# EasyEDA Pro project ProDocument_PCB1_2023-08-22.epro

# Board PCB1
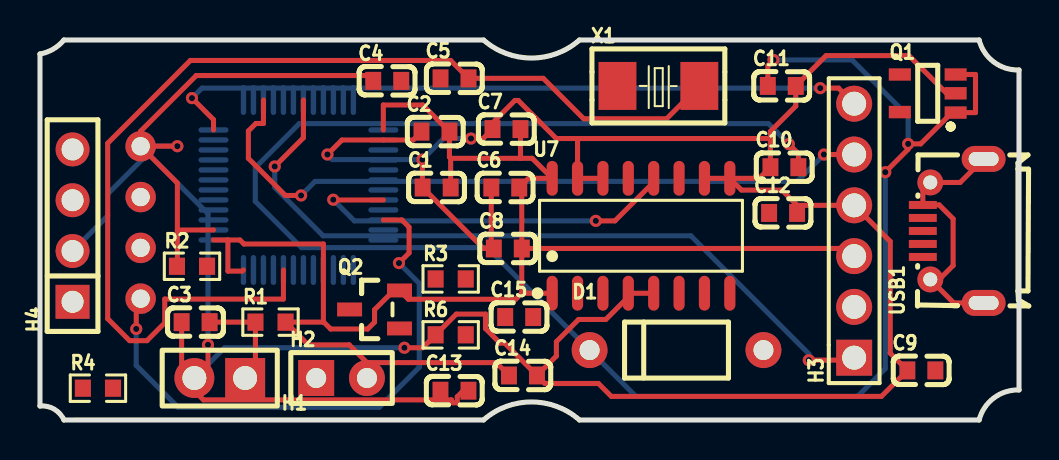
[diagram p0: board, top side]
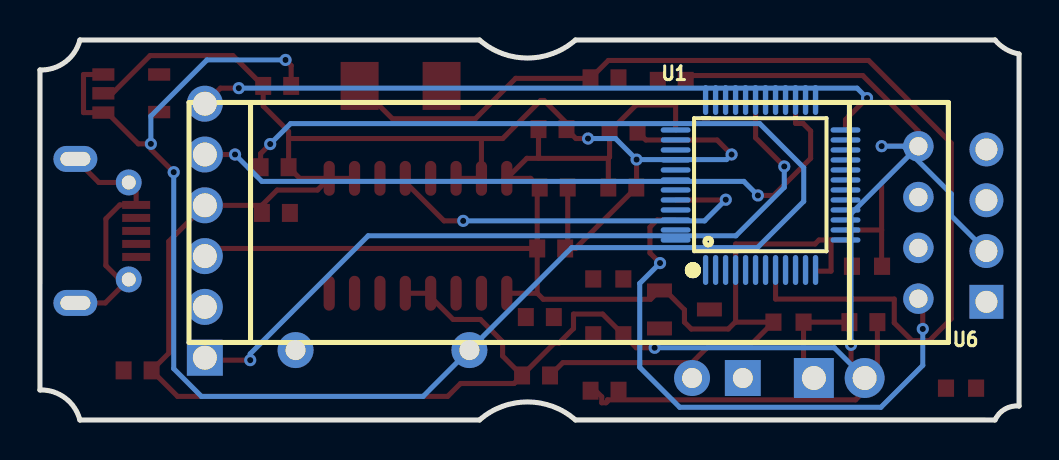
[diagram p1: board, bottom side, seen from below]

Outline 49 x 19 mm; copper layers: Top Layer, Bottom Layer. Coordinates in mm from the lower left corner of the outline.
Outline path: 0,0.7 0,18.3 arc(0.66,18.54) 1.2,19 22.2,19 arc(24.6,18.1) 27,19 47,19 arc(47.74,17.9) 49,17.5 49,1.5 arc(47.74,1.1) 47,0 27,0 arc(24.6,0.9) 22.2,0 1.2,0 arc(0.71,0.54) 0,0.7
Stack: Top Layer 0.035mm / Dielectric1 1.51mm FR4 er 4.5 / Bottom Layer 0.035mm

## Design rules (mm)
spacing safeClearance (default): track to track 0.152, other pairs 0.152 to 0.3
track width trackWidth (default): min 0.127, default 0.254, max 2.54
differential pair differentialPair (default): width min 0.127, default 0.254, max 2.54; gap min 0.152, default 0.152
via viaSize (default): diameter min 0.5, default 0.61, max 10; hole min 0.3, default 0.305, max 6

## Placement (name value [footprint] x y rotation side)
C1  100nF  [C0603]  19.86 11.62 0 top
C2  4.7nF  [C0603]  19.79 14.42 0 top
C3  100nF  [C0603]  7.79 4.89 0 top
C4  12pF  [C0603]  17.38 16.96 0 top
C5  12pF  [C0603]  20.75 17.09 0 top
C6  100nF  [C0603]  23.29 11.62 0 top
C7  100nF  [C0603]  23.35 14.55 0 top
C8  100nF  [C0603]  23.41 8.58 0 top
C9  100nF  [C0603]  44.11 2.48 0 top
C10  100nF  [C0603]  37.26 12.64 0 top
C11  22uF  [C0603]  37.13 16.7 0 top
C12  22uF  [C0603]  37.19 10.35 0 top
C13  10uF  [C0603]  20.74 1.46 0 top
C14  10uF  [C0603]  24.17 2.23 0 top
C15  0.1uF  [C0603]  23.98 5.15 0 top
D1  -  [DO-41_BD2.4-L4.7-P8.70-D0.9-RD]  31.86 3.5 0 top
H1  -  [HDR-TH_2P-P2.54-V-F]  9 2.1 180 top
H2  -  [HDR-TH_2P-P2.54-V-M-1]  15.09 2.1 0 top
H3  -  [HDR-TH_6P-P2.54-V-M-1]  40.75 9.47 90 top
H4  -  [HDR-TH_4P-P2.54-V-M]  1.63 9.72 90 top
Q1  -  [SOT-25-5_L3.0-W1.8-P0.95-LS3.0-BR]  44.43 16.32 0 top
Q2  -  [TO-236-3_L2.9-W1.3-P1.90-LS2.4-BR]  16.74 5.53 0 top
R1  10kΩ  [R0603]  11.54 4.89 0 top
R2  10kΩ  [R0603]  7.61 7.69 0 top
R3  1kΩ  [R0603]  20.55 7.05 0 top
R4  1kΩ  [R0603]  2.9 1.59 0 top
R6  0R  [R0603]  20.55 4.26 0 top
U1  N32G430C8L7  [LQFP-48_L7.0-W7.0-P0.50-LS9.0-BL]  12.93 11.75 180 bottom
U6  0.91OLED-IIC-IO4  [0.91-OLED-IIC-12832]  3.54 3.88 0 bottom
U7  HX711  [SOP-16_L10.0-W3.9-P1.27-LS6.0-BL]  30.08 9.21 0 top
USB1  MicroXNJ  [MICRO-USB-SMD_MICROXNJ]  45.71 9.45 90 top
X1  8MHz  [OSC-SMD_L5.0-W3.2]  30.95 16.7 0 top

## Footprints (pads in the part's own frame, mm; a bottom-side part is the same pattern mirrored in y, then rotated)
0.91-OLED-IIC-12832
  round 1.524 hole 0.914: 1(1.501,-2.189) 2(1.501,-4.729) 3(1.501,-7.269) 4(1.501,-9.809)
C0603
  rect 0.8x0.9 smd: 1(-0.7,0) 2(0.7,0)
DO-41_BD2.4-L4.7-P8.70-D0.9-RD
  round 1.8 hole 1: 1(-4.35,0) 2(4.35,0)
HDR-TH_2P-P2.54-V-F
  rect 1.999x1.999 hole 1.199: 1(-1.27,0)
  round 1.999 hole 1.199: 2(1.27,0)
HDR-TH_2P-P2.54-V-M-1
  rect 1.8x1.8 hole 1: 1(-1.27,0)
  round 1.8 hole 1: 2(1.27,0)
HDR-TH_4P-P2.54-V-M
  rect 1.7x1.7 hole 1.1: 1(-3.81,0)
  round 1.7 hole 1.1: 2(-1.27,0) 3(1.27,0) 4(3.81,0)
HDR-TH_6P-P2.54-V-M-1
  rect 1.801x1.801 hole 1.199: 1(-6.35,0)
  round 1.801 hole 1.199: 2(-3.81,0) 3(-1.27,0) 4(1.27,0) 5(3.81,0) 6(6.35,0)
LQFP-48_L7.0-W7.0-P0.50-LS9.0-BL
  oval 0.27x1.5 smd: 1(-2.75,-4.25) 2(-2.25,-4.25) 3(-1.75,-4.25) 4(-1.25,-4.25) 5(-0.75,-4.25) 6(-0.25,-4.25) 7(0.25,-4.25) 8(0.75,-4.25) 9(1.25,-4.25) 10(1.75,-4.25) 11(2.25,-4.25) 12(2.75,-4.25) 25(2.75,4.25) 26(2.25,4.25) 27(1.75,4.25) 28(1.25,4.25) 29(0.75,4.25) 30(0.25,4.25) 31(-0.25,4.25) 32(-0.75,4.25) 33(-1.25,4.25) 34(-1.75,4.25) 35(-2.25,4.25) 36(-2.75,4.25)
  oval 1.5x0.27 smd: 13(4.25,-2.75) 14(4.25,-2.25) 15(4.25,-1.75) 16(4.25,-1.25) 17(4.25,-0.75) 18(4.25,-0.25) 19(4.25,0.25) 20(4.25,0.75) 21(4.25,1.25) 22(4.25,1.75) 23(4.25,2.25) 24(4.25,2.75) 37(-4.25,2.75) 38(-4.25,2.25) 39(-4.25,1.75) 40(-4.25,1.25) 41(-4.25,0.75) 42(-4.25,0.25) 43(-4.25,-0.25) 44(-4.25,-0.75) 45(-4.25,-1.25) 46(-4.25,-1.75) 47(-4.25,-2.25) 48(-4.25,-2.75)
MICRO-USB-SMD_MICROXNJ
  rect 0.4x1.4 smd: 1(-1.3,1.522) 2(-0.65,1.522) 3(0,1.522) 4(0.65,1.522) 5(1.3,1.522)
  round 1.3 hole 0.7: 6(2.425,1.149) 9(-2.425,1.149)
  oval 1.3x2.2 hole 0.7x1.5: 7(3.6,-1.522) 8(-3.6,-1.522)
OSC-SMD_L5.0-W3.2
  rect 1.9x2.4 smd: 1(-2.05,0) 2(2.05,0)
R0603
  rect 0.806x0.864 smd: 1(-0.753,0) 2(0.753,0)
SOP-16_L10.0-W3.9-P1.27-LS6.0-BL
  oval 0.56x1.745 smd: 1(-4.445,-2.873) 2(-3.175,-2.873) 3(-1.905,-2.873) 4(-0.635,-2.873) 5(0.635,-2.873) 6(1.905,-2.873) 7(3.175,-2.873) 8(4.445,-2.873) 9(4.445,2.873) 10(3.175,2.873) 11(1.905,2.873) 12(0.635,2.873) 13(-0.635,2.873) 14(-1.905,2.873) 15(-3.175,2.873) 16(-4.445,2.873)
SOT-25-5_L3.0-W1.8-P0.95-LS3.0-BR
  rect 1.105x0.623 smd: 1(1.397,-0.953) 2(1.397,0.013) 3(1.397,0.953) 4(-1.397,0.953) 5(-1.397,-0.927)
TO-236-3_L2.9-W1.3-P1.90-LS2.4-BR
  rect 1.25x0.701 smd: 1(1.25,-0.95) 2(1.25,0.95) 3(-1.25,0)

## Nets
3V3: C1.2 C2.2 C6.2 C7.2 C8.2 C14.1 H2.2 H3.3 Q2.2 R1.2 U1.1 U1.9 U1.24 U1.48 U7.1 U7.16
GND: C1.1 C2.1 C3.1 C4.1 C5.1 C6.1 C7.1 C8.1 C9.1 C10.1 C11.2 C12.2 C13.2 C14.2 H1.2 H3.4 H4.2 Q1.2 R2.1 R6.1 U1.8 U1.23 U1.47 U6.4 U7.4 U7.5 U7.9 U7.10 U7.14 U7.15
VCC3.3V: C9.2 C12.1 Q1.5 U6.3
BOOT: H2.1 R2.2 U1.44
DOUT: U1.17 U7.12
NRST: C3.2 H1.1 R1.1 U1.7
OLED_SCK: U1.14 U6.2
OLED_SDA: U1.15 U6.1
OSC_IN: C5.2 U1.5 X1.2
OSC_OUT: C4.2 U1.6 X1.1
PD_SCK: U1.18 U7.11
RXD: H3.2 U1.31
SWCLK: H3.6 U1.37
SWDIO: H3.5 U1.34
TXD: H3.1 U1.30
VUSB: C10.2 C11.1 D1.1 Q1.1 Q1.3
$1N8166: C13.1 D1.2 USB1.1
$1N8294: R6.2 USB1.5 USB1.6 USB1.7 USB1.8 USB1.9
$1N9457: Q2.1 U7.2
$1N9510: H4.1 Q2.3 U7.3
$1N10604: H4.3 R3.2
$1N10692: H4.4 R4.2
$1N10752: C15.1 R3.1 U7.7
$1N10811: C15.2 R4.1 U7.8

Pads without a net: Q1 4; U1 2 3 4 10 11 12 13 16 19 20 21 22 25 26 27 28 29 32 33 35 36 38 39 40 41 42 43 45 46; U7 6 13; USB1 2 3 4

## Via types
v1: diameter 0.61, hole 0.305, Top Layer to Bottom Layer, 20 vias

## Routing (per net, layer and track width the routed paths; a pad name or vN(x,y) marks a point on that pad's centre or on a via; arc(x,y) is an arc through that point)
3V3: length 78.7
  Top Layer w0.254: C14.1 22.83,2.87 16.36,2.87 ; H3.3 40.37,8.58 C8.2 ; 10.18,7.5 10.13,7.44 9.41,7.44 9.41,9 ; C8.2 24.11,6.34 ; C8.2 24.11,11.5 23.99,11.62 24.45,12.08 U7.16 24.63,13.08 24.05,13.08 ; 20.55,13.08 24.05,13.08 ; 20.55,13.08 C1.2 ; 20.55,13.08 20.49,13.15 C2.2 19.16,15.75 17.18,15.75 17.18,14.5 ; 24.05,13.08 C7.2 ; 9.41,9 8.68,9 ; 9.41,9 10.01,9 10.21,8.8 14.18,8.8 14.18,4.89 ; 24.11,6.34 23.81,6.04 18.44,6.04 Q2.2 17.71,6.48 16.74,5.51 16.74,4.89 16.4,4.55 14.55,4.55 14.2,4.9 14.18,4.89 ; 24.11,6.34 U7.1 ; 14.18,4.89 R1.2 13.42,3.76 15.47,3.76 16.36,2.87 ; H2.2 16.36,2.87
GND: length 188.2
  Top Layer w0.254: 37.89,10.74 37.13,11.5 35.11,11.5 U7.9 ; 37.89,10.74 C12.2 ; 37.89,10.74 40.75,10.74 42.56,8.93 42.56,3.34 C9.1 42.11,1.18 28.59,1.18 27.95,1.83 25.27,1.83 C14.2 ; 22.59,8.58 C8.1 ; 22.59,8.58 C6.1 ; 22.59,8.58 22.2,8.58 C1.1 19.14,11.64 v1(19.14,13.02) ; C14.2 25.85,3.2 25.85,3.92 26.96,5.03 28.32,5.03 29.45,6.15 U7.4 U7.5 ; C14.2 23.25,3.85 23.02,3.85 22.3,4.57 22.3,5.3 20.84,5.3 R6.1 19.16,3.61 v1(18.24,3.61) ; 26.9,14.07 U7.15 U7.14 ; 26.9,14.07 36.56,14.07 ; 26.9,14.07 25.84,14.07 23.94,15.98 23.77,15.98 22.65,14.86 22.65,14.55 22.18,14.07 v1(21.57,14.07) ; 36.56,14.07 C10.1 36,12.08 U7.9 ; 36.56,14.07 36.56,14.43 37.83,15.7 37.83,16.7 39.34,18.22 43.49,18.22 45.37,16.34 Q1.2 ; C4.1 16.42,17.22 7.82,17.22 5.04,14.44 5.04,13.69 ; 5.04,13.69 U6.4 6.88,11.85 6.88,9.5 ; 5.04,13.69 v1(6.88,13.69) ; C13.2 21.19,1.46 20.88,1.16 20.88,0.86 20.67,0.86 20.6,0.93 20.6,1.01 8.18,1.01 7.09,2.1 ; 6.88,9.5 6.88,7.71 R2.1 ; 6.88,9.5 8.68,9.5 ; v1(8.41,3.76) 8.41,2.78 H1.2 7.09,2.1 ; 7.09,2.1 C3.1 ; U7.9 U7.10 ; v1(14.39,13.28) 15.11,14 17.18,14 18.68,14 C2.1
  Bottom Layer w0.254: 5.41,13.32 3.39,11.3 3.39,10.21 H4.2 ; 5.41,13.32 8.41,10.32 v1(8.41,3.76) ; 5.41,13.32 5.78,13.69 v1(6.88,13.69) ; 5.41,13.32 U6.4 ; v1(14.39,13.28) 14.64,13.02 v1(19.14,13.02) 20.19,14.07 v1(21.57,14.07) ; v1(18.24,3.61) 9.24,3.61 H1.2
DOUT: length 20
  Top Layer w0.254: v1(14.68,11.02) 14.69,11 17.18,11 ; U7.12 30.71,11.9 28.78,9.96 v1(27.82,9.96)
  Bottom Layer w0.254: v1(27.82,9.96) 15.74,9.96 v1(14.68,11.02)
NRST: length 5.3
  Top Layer w0.254: H1.1 10.78,2.62 R1.1 C3.2
OLED_SDA: length 28.4
  Top Layer w0.254: v1(4.82,4.55) 4.82,5.85 U6.1 ; v1(17.97,7.85) 18.47,8.35 18.47,9.64 18.11,10 17.18,10
  Bottom Layer w0.254: v1(17.97,7.85) 18.98,6.83 18.98,2.64 16.98,0.64 6.91,0.64 4.82,2.73 v1(4.82,4.55)
OSC_IN: length 54.2
  Top Layer w0.254: 12.18,7.5 12.18,6.05 6.25,6.05 6.25,4.86 5.36,3.97 4.49,3.97 3.39,5.06 3.39,13.84 7.53,17.98 20.55,17.98 C5.2 25.19,17.09 27.21,15.06 31.36,15.06 33,16.7
SWCLK: length 35.7
  Top Layer w0.254: v1(7.61,16.1) 8.68,15.02 8.68,14.5 ; v1(39.05,16.59) 39.97,16.59 40.75,15.82
  Bottom Layer w0.254: v1(39.05,16.59) 8.11,16.59 v1(7.61,16.1)
SWDIO: length 35.4
  Top Layer w0.254: 11.18,16 11.18,14.83 10.81,14.83 10.43,14.45 10.43,13.08 12.28,11.23 v1(13.07,11.23) ; v1(39.24,13.28) H3.5
  Bottom Layer w0.254: v1(39.24,13.28) 37.89,11.93 13.77,11.93 v1(13.07,11.23)
TXD: length 37.8
  Top Layer w0.254: 13.18,16 13.18,14.11 v1(11.75,12.68) ; v1(38.48,2.99) 40.63,2.99 H3.1
  Bottom Layer w0.254: v1(38.48,2.99) 38.48,3.31 32.57,9.21 14.17,9.21 11.75,11.63 v1(11.75,12.68)
VUSB: length 96.6
  Top Layer w0.254: C11.1 36.43,17.72 v1(36.71,18) ; C10.2 37.96,13.32 v1(37.48,13.8) ; v1(42.31,12.39) 43.45,13.54 v1(43.45,13.81) 44.08,13.81 45.64,15.37 Q1.1 46.82,15.37 46.82,17.28 Q1.3
  Bottom Layer w0.254: v1(37.48,13.8) 36.46,14.82 12.98,14.82 10.78,12.62 10.78,10.93 13.09,8.62 22.39,8.62 D1.1 29.82,1.18 40.92,1.18 42.31,2.57 v1(42.31,12.39) ; v1(36.71,18) 40.64,18 43.45,15.2 v1(43.45,13.81)
$1N8294: length 13.2
  Top Layer w0.254: USB1.7 46.05,11.88 USB1.6 44.19,11.51 44.19,10.75 45.01,10.75 45.7,10.06 45.7,7.72 45.01,7.03 USB1.9 45.73,5.85 47.23,5.85
